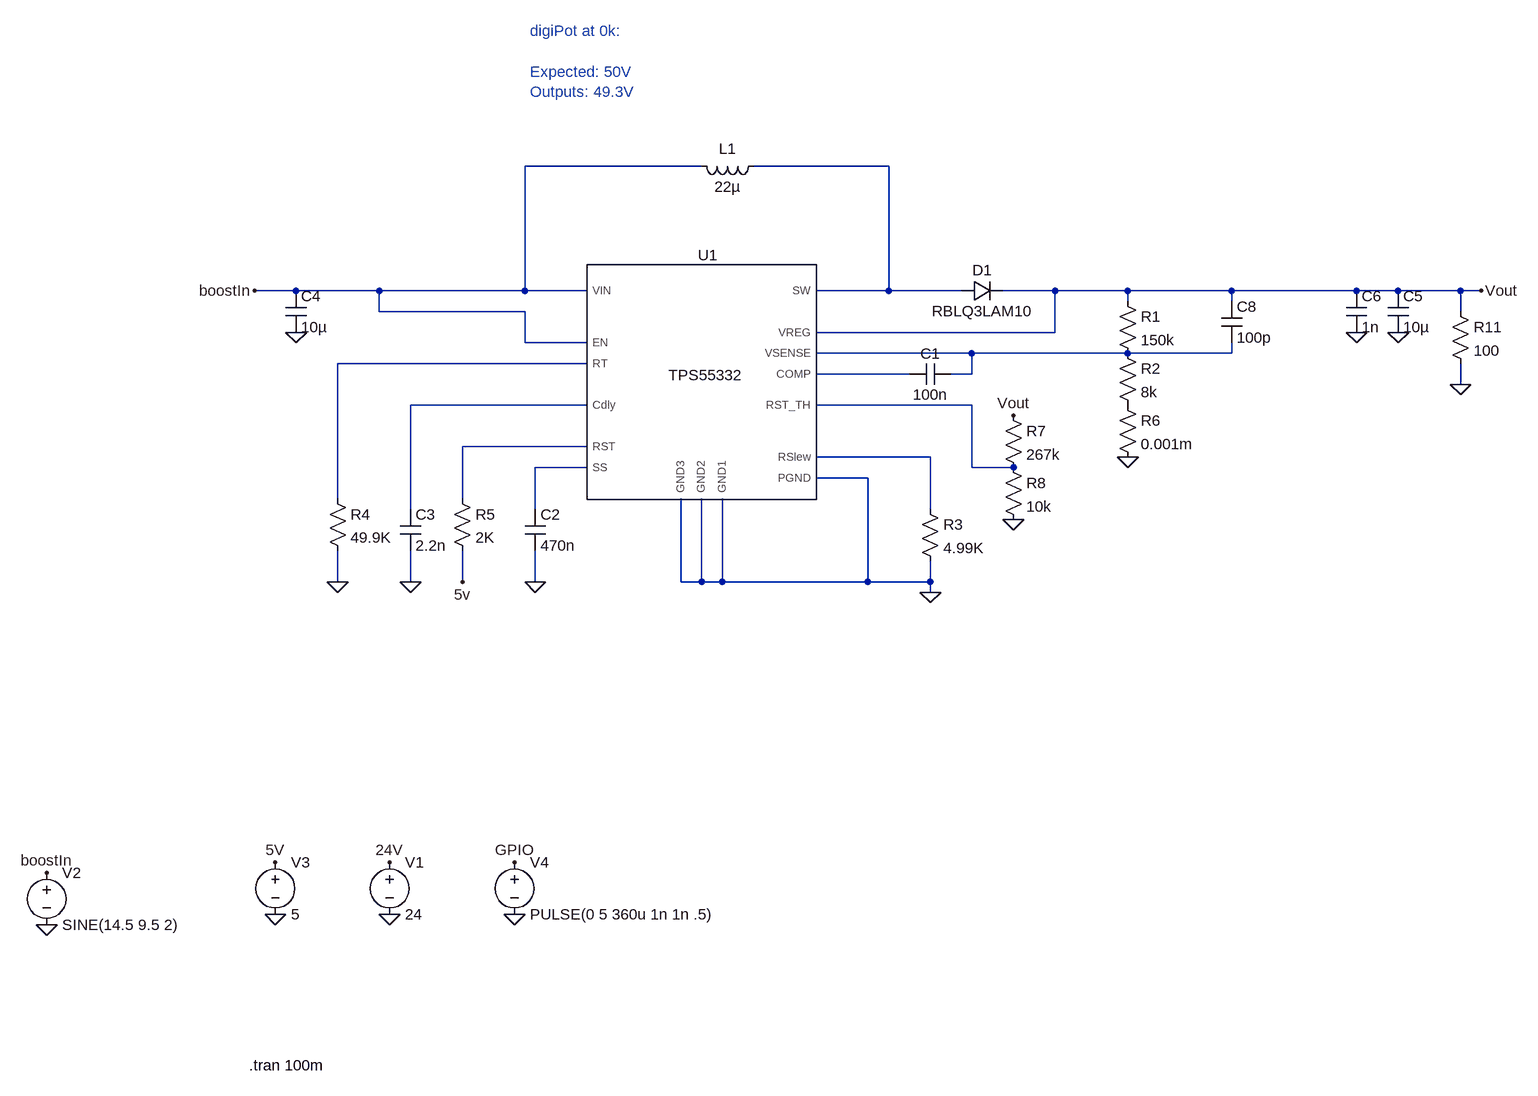
[diagram p0: schematic TPS55332.asc]
TPS55332.asc, the LTspice schematic file:
Version 4.1
SHEET 1 1664 1272
WIRE 320 -128 48 -128
WIRE 608 -128 400 -128
WIRE -304 64 -368 64
WIRE -176 64 -304 64
WIRE 48 64 48 -128
WIRE 48 64 -176 64
WIRE 144 64 48 64
WIRE 608 64 608 -128
WIRE 608 64 496 64
WIRE 720 64 608 64
WIRE 864 64 784 64
WIRE 976 64 864 64
WIRE 1136 64 976 64
WIRE 1328 64 1136 64
WIRE 1392 64 1328 64
WIRE 1488 64 1392 64
WIRE 1520 64 1488 64
WIRE 976 80 976 64
WIRE 1136 80 1136 64
WIRE -176 96 -176 64
WIRE 48 96 -176 96
WIRE 1488 96 1488 64
WIRE 864 128 864 64
WIRE 864 128 496 128
WIRE 48 144 48 96
WIRE 144 144 48 144
WIRE 736 160 496 160
WIRE 976 160 736 160
WIRE 1136 160 1136 144
WIRE 1136 160 976 160
WIRE 144 176 -240 176
WIRE 640 192 496 192
WIRE 736 192 736 160
WIRE 736 192 704 192
WIRE 1488 208 1488 176
WIRE 144 240 -128 240
WIRE 736 240 496 240
WIRE 144 304 -48 304
WIRE 672 320 496 320
WIRE 144 336 64 336
WIRE 736 336 736 240
WIRE 800 336 736 336
WIRE 576 352 496 352
WIRE -240 384 -240 176
WIRE -48 384 -48 304
WIRE -128 400 -128 240
WIRE 64 400 64 336
WIRE 672 400 672 320
WIRE -240 512 -240 464
WIRE -128 512 -128 464
WIRE -48 512 -48 464
WIRE 64 512 64 464
WIRE 288 512 288 384
WIRE 320 512 320 384
WIRE 320 512 288 512
WIRE 352 512 352 384
WIRE 352 512 320 512
WIRE 576 512 576 352
WIRE 576 512 352 512
WIRE 672 512 672 480
WIRE 672 512 576 512
WIRE 672 528 672 512
FLAG 672 528 0
FLAG -240 512 0
FLAG -160 1024 0
FLAG -160 944 24V
FLAG -48 512 5v
FLAG 64 512 0
FLAG -128 512 0
FLAG -304 128 0
FLAG 1392 128 0
FLAG 1328 128 0
FLAG 1520 64 Vout
FLAG 800 256 Vout
FLAG 1488 208 0
FLAG 800 416 0
FLAG 976 320 0
FLAG -336 1024 0
FLAG -336 944 5V
FLAG 32 1024 0
FLAG 32 944 GPIO
FLAG -368 64 boostIn
FLAG -688 1040 0
FLAG -688 960 boostIn
SYMBOL TPS55332 320 192 R0
SYMATTR InstName U1
SYMBOL ind 416 -144 R90
WINDOW 0 5 56 VBottom 2
WINDOW 3 32 56 VTop 2
SYMATTR InstName L1
SYMATTR Value 22µ
SYMATTR SpiceLine Rser=1m
SYMBOL diode 720 80 R270
WINDOW 0 32 32 VTop 2
WINDOW 3 0 32 VBottom 2
SYMATTR InstName D1
SYMATTR Value RBLQ3LAM10
SYMBOL res 960 64 R0
SYMATTR InstName R1
SYMATTR Value 150k
SYMBOL res 960 144 R0
SYMATTR InstName R2
SYMATTR Value 8k
SYMBOL cap 704 176 R90
WINDOW 0 0 32 VBottom 2
WINDOW 3 32 32 VTop 2
SYMATTR InstName C1
SYMATTR Value 100n
SYMBOL res 656 384 R0
SYMATTR InstName R3
SYMATTR Value 4.99K
SYMBOL res -256 368 R0
SYMATTR InstName R4
SYMATTR Value 49.9K
SYMBOL res -64 368 R0
SYMATTR InstName R5
SYMATTR Value 2K
SYMBOL voltage -160 928 R0
WINDOW 123 0 0 Left 0
WINDOW 39 0 0 Left 0
SYMATTR InstName V1
SYMATTR Value 24
SYMBOL cap 48 400 R0
SYMATTR InstName C2
SYMATTR Value 470n
SYMBOL cap -144 400 R0
SYMATTR InstName C3
SYMATTR Value 2.2n
SYMBOL cap -320 64 R0
SYMATTR InstName C4
SYMATTR Value 10µ
SYMBOL cap 1376 64 R0
SYMATTR InstName C5
SYMATTR Value 10µ
SYMBOL cap 1312 64 R0
SYMATTR InstName C6
SYMATTR Value 1n
SYMBOL res 784 240 R0
SYMATTR InstName R7
SYMATTR Value 267k
SYMBOL res 784 320 R0
SYMATTR InstName R8
SYMATTR Value 10k
SYMBOL res 960 224 R0
SYMATTR InstName R6
SYMATTR Value 0.001m
SYMBOL voltage -336 928 R0
WINDOW 123 0 0 Left 0
WINDOW 39 0 0 Left 0
SYMATTR InstName V3
SYMATTR Value 5
SYMBOL voltage 32 928 R0
WINDOW 123 0 0 Left 0
WINDOW 39 0 0 Left 0
SYMATTR InstName V4
SYMATTR Value PULSE(0 5 360u 1n 1n .5)
SYMBOL res 1472 80 R0
SYMATTR InstName R11
SYMATTR Value 100
SYMBOL cap 1120 80 R0
SYMATTR InstName C8
SYMATTR Value 100p
SYMBOL voltage -688 944 R0
WINDOW 123 0 0 Left 0
WINDOW 39 0 0 Left 0
SYMATTR InstName V2
SYMATTR Value SINE(14.5 9.5 2)
TEXT 56 -336 Left 2 ;digiPot at 0k:\n \nExpected: 50V\nOutputs: 49.3V
TEXT -376 1256 Left 2 !.tran 100m

The netlist it stands for:
* TPS55332.asc
X§U1 boostIn N001 boostIn 0 Vout N007 N003 N006 N008 N004 0 0 0 N005 N002 N009 TPS55332  ; pins EN SW VIN PGND VREG RST RT RST_TH RSlew COMP GND1 GND2 GND3 Cdly VSENSE SS
L1 N001 boostIn 22µ Rser=1m
D1 N001 Vout RBLQ3LAM10
R1 Vout N002 150k
R2 N002 P001 8k
C1 N002 N004 100n
R3 N008 0 4.99K
R4 N003 0 49.9K
R5 N007 5v 2K
V1 24V 0 24
C2 N009 0 470n
C3 N005 0 2.2n
C4 boostIn 0 10µ
C5 Vout 0 10µ
C6 Vout 0 1n
R7 Vout N006 267k
R8 N006 0 10k
R6 P001 0 0.001m
V3 5v 0 5
V4 GPIO 0 PULSE(0 5 360u 1n 1n .5)
R11 Vout 0 100
C8 Vout N002 100p
V2 boostIn 0 SINE(14.5 9.5 2)
.model D D
.lib standard.dio
* digiPot at 0k:
* Expected: 50V
* Outputs: 49.3V
.tran 100m
.lib TPS55332_Q1.lib
.backanno
.end